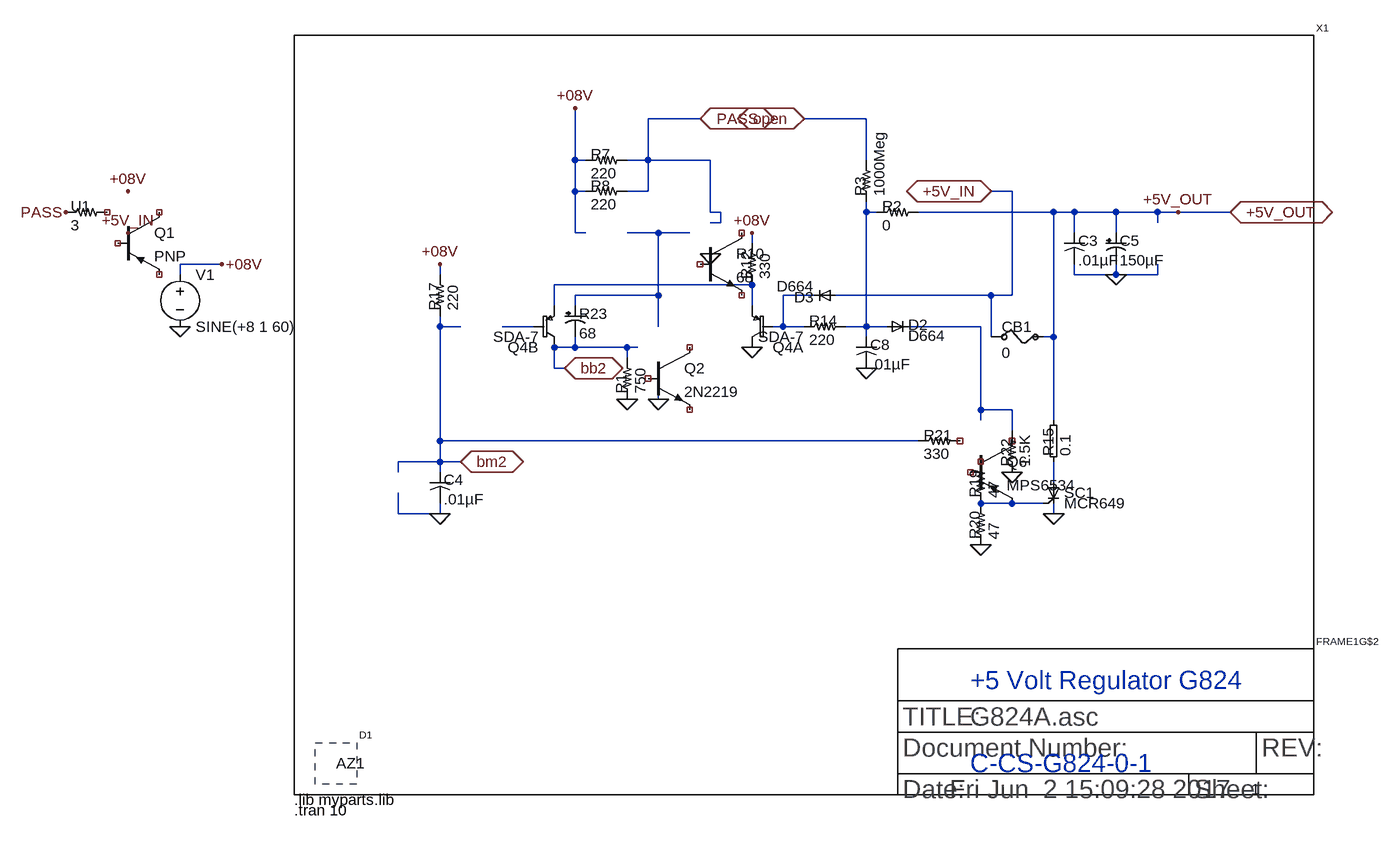
[diagram p0: schematic G824A.asc]
G824A.asc, the LTspice schematic file:
Version 4
SHEET 1 1572 36
WIRE 624 -1040 544 -1040
WIRE 880 -1040 784 -1040
WIRE 432 -976 432 -1056
WIRE 448 -976 432 -976
WIRE 544 -976 544 -1040
WIRE 544 -976 512 -976
WIRE 640 -976 544 -976
WIRE 880 -976 880 -1040
WIRE 432 -928 432 -976
WIRE 448 -928 432 -928
WIRE 544 -928 544 -976
WIRE 544 -928 512 -928
WIRE 1104 -928 1072 -928
WIRE 640 -896 640 -976
WIRE 656 -896 640 -896
WIRE 880 -896 880 -912
WIRE 896 -896 880 -896
WIRE 1168 -896 960 -896
WIRE 1200 -896 1168 -896
WIRE 1264 -896 1200 -896
WIRE 1328 -896 1264 -896
WIRE 1360 -896 1328 -896
WIRE 1440 -896 1360 -896
WIRE 656 -880 656 -896
WIRE 656 -880 640 -880
WIRE 1328 -880 1328 -896
WIRE 432 -864 432 -928
WIRE 448 -864 432 -864
WIRE 560 -864 512 -864
WIRE 608 -864 560 -864
WIRE 1200 -864 1200 -896
WIRE 1264 -864 1264 -896
WIRE 704 -848 704 -864
WIRE -112 -816 -176 -816
WIRE -176 -800 -176 -816
WIRE 224 -800 224 -816
WIRE 1200 -800 1200 -816
WIRE 1264 -800 1264 -816
WIRE 1264 -800 1200 -800
WIRE 1328 -800 1328 -816
WIRE 1328 -800 1264 -800
WIRE 704 -784 400 -784
WIRE 560 -768 560 -864
WIRE 560 -768 432 -768
WIRE 800 -768 752 -768
WIRE 1072 -768 832 -768
WIRE 1104 -768 1104 -928
WIRE 1104 -768 1072 -768
WIRE 400 -752 400 -784
WIRE 432 -752 432 -768
WIRE 704 -752 704 -784
WIRE 224 -720 224 -736
WIRE 256 -720 224 -720
WIRE 368 -720 320 -720
WIRE 560 -720 560 -768
WIRE 752 -720 752 -768
WIRE 752 -720 736 -720
WIRE 784 -720 752 -720
WIRE 880 -720 880 -896
WIRE 880 -720 848 -720
WIRE 912 -720 880 -720
WIRE 1056 -720 944 -720
WIRE 880 -704 880 -720
WIRE 1072 -704 1072 -768
WIRE 1168 -704 1168 -896
WIRE 1168 -704 1152 -704
WIRE 432 -688 432 -704
WIRE 432 -688 400 -688
WIRE 512 -688 432 -688
WIRE 528 -688 512 -688
WIRE 512 -672 512 -688
WIRE 400 -656 400 -688
WIRE 416 -656 400 -656
WIRE 560 -608 560 -656
WIRE 1056 -592 1056 -720
WIRE 1104 -592 1056 -592
WIRE 1056 -576 1056 -592
WIRE 1168 -576 1168 -704
WIRE 1104 -560 1104 -592
WIRE 224 -544 224 -720
WIRE 960 -544 224 -544
WIRE 224 -512 224 -544
WIRE 224 -512 160 -512
WIRE 256 -512 224 -512
WIRE 160 -496 160 -512
WIRE 224 -496 224 -512
WIRE 1168 -480 1168 -512
WIRE 1152 -448 1056 -448
WIRE 160 -432 160 -464
WIRE 224 -432 224 -448
WIRE 224 -432 160 -432
WIRE 1168 -432 1168 -448
FLAG 1360 -896 +5V_OUT
FLAG 224 -432 0
FLAG 704 -688 0
FLAG 432 -1056 +08V
FLAG 560 -608 0
FLAG 512 -608 0
FLAG 704 -864 +08V
FLAG 640 -832 0
FLAG 224 -816 +08V
FLAG 1056 -384 0
FLAG 1104 -496 0
FLAG 1264 -800 0
FLAG 880 -656 0
FLAG 1168 -432 0
FLAG 256 -512 bm2
IOPIN 256 -512 BiDir
FLAG 416 -656 bb2
IOPIN 416 -656 BiDir
FLAG 1072 -928 +5V_IN
IOPIN 1072 -928 BiDir
FLAG 1440 -896 +5V_OUT
IOPIN 1440 -896 BiDir
FLAG 624 -1040 PASS
IOPIN 624 -1040 BiDir
FLAG 784 -1040 open
IOPIN 784 -1040 BiDir
FLAG -176 -720 0
FLAG -112 -816 +08V
FLAG -352 -896 PASS
FLAG -256 -928 +08V
FLAG -256 -864 +5V_IN
SYMBOL DOCFIELD 928 0 R0
SYMATTR InstName FRAME1G$2
SYMATTR Value 1
SYMBOL DEVICE 64 -48 R0
SYMATTR InstName U$1
SYMATTR Value OUTLINE-DOUBLE
SYMBOL R-US 288 -720 MR0
SYMATTR InstName R13
SYMATTR Value 220
SYMATTR SpiceLine pwr=0.5W
SYMBOL ZD 160 -480 MR270
SYMATTR InstName D1
SYMATTR Value AZ1
SYMBOL C-US 224 -480 R0
SYMATTR InstName C4
SYMATTR Value .01µF
SYMATTR Prefix C
SYMBOL R-US 816 -720 R0
SYMATTR InstName R14
SYMATTR Value 220
SYMATTR SpiceLine pwr=0.5W
SYMBOL R-US 224 -768 R270
SYMATTR InstName R17
SYMATTR Value 220
SYMATTR SpiceLine pwr=0.5W
SYMBOL R-US 480 -976 R0
SYMATTR InstName R7
SYMATTR Value 220
SYMATTR SpiceLine pwr=0.5W
SYMBOL R-US 480 -928 R0
SYMATTR InstName R8
SYMATTR Value 220
SYMATTR SpiceLine pwr=0.5W
SYMBOL PNP-L 720 -720 R180
SYMATTR InstName Q4A
SYMATTR Value SDA-7
SYMATTR Prefix Q
SYMBOL PNP-R 448 -720 R180
SYMATTR InstName Q4B
SYMATTR Value SDA-7
SYMATTR Prefix Q
SYMBOL NPN 624 -864 R0
SYMATTR InstName Q3A
SYMATTR Value DEC3715
SYMBOL R-US_ 480 -864 MR0
SYMATTR InstName R10
SYMATTR Value 68
SYMATTR Prefix R
SYMATTR SpiceLine pwr=1W
SYMBOL NPN 544 -688 R0
SYMATTR InstName Q2
SYMATTR Value 2N2219
SYMBOL R-US 512 -640 R270
SYMATTR InstName R1
SYMATTR Value 750
SYMBOL R-US 704 -816 R270
SYMATTR InstName R12
SYMATTR Value 330
SYMATTR SpiceLine tol=5%
SYMBOL CPOL-US 432 -736 R0
SYMATTR InstName C21
SYMATTR Value 1µF
SYMBOL R-US_ 1328 -848 MR90
SYMATTR InstName R23
SYMATTR Value 68
SYMATTR Prefix R
SYMATTR SpiceLine pwr=1W
SYMBOL R-US 992 -544 R0
SYMATTR InstName R21
SYMATTR Value 330
SYMATTR SpiceLine tol=5%
SYMBOL PNP 1040 -544 R0
SYMATTR InstName Q6
SYMATTR Value MPS6534
SYMBOL R-US 1056 -480 R270
SYMATTR InstName R19
SYMATTR Value 47
SYMBOL R-US 1056 -416 R270
SYMATTR InstName R20
SYMATTR Value 47
SYMBOL R-US 1104 -528 R270
SYMATTR InstName R22
SYMATTR Value 1.5K
SYMATTR SpiceLine tol=5%
SYMBOL R 1168 -544 R270
SYMATTR InstName R15
SYMATTR Value 0.1
SYMATTR Prefix R
SYMATTR SpiceLine tol=5% pwr=5W
SYMBOL CPOL-US 1264 -848 R0
SYMATTR InstName C5
SYMATTR Value 150µF
SYMBOL C-US 1200 -848 R0
SYMATTR InstName C3
SYMATTR Value .01µF
SYMATTR Prefix C
SYMBOL C-US 880 -688 R0
SYMATTR InstName C8
SYMATTR Value .01µF
SYMATTR Prefix C
SYMBOL R-US 928 -896 R0
SYMATTR InstName R2
SYMATTR Value 0
SYMBOL R-US 880 -944 R270
SYMATTR InstName R3
SYMATTR Value 1000Meg
SYMBOL D 928 -720 R0
SYMATTR InstName D2
SYMATTR Value D664
SYMBOL D 816 -768 R180
SYMATTR InstName D3
SYMATTR Value D664
SYMBOL SCR 1168 -464 R0
SYMATTR InstName SC1
SYMATTR Value MCR649
SYMBOL BREAKER 1120 -704 R0
SYMATTR InstName CB1
SYMATTR Value 0
SYMATTR Prefix R
SYMBOL LETTER_L 0 0 R0
SYMATTR InstName X1
SYMBOL voltage -176 -816 R0
WINDOW 123 24 32 Left 2
WINDOW 39 24 32 Left 2
SYMATTR InstName V1
SYMATTR Value SINE(+8 1 60)
SYMBOL R-US_ -320 -896 R0
SYMATTR InstName U1
SYMATTR Value 3
SYMATTR Prefix R
SYMBOL pnp -272 -896 R0
SYMATTR InstName Q1
TEXT 1040 -176 Left 4 ;+5 Volt Regulator G824
TEXT 1040 -48 Left 4 ;C-CS-G824-0-1
TEXT 0 8 Left 2 !.lib myparts.lib
TEXT 0 24 Left 2 !.tran 10

The netlist it stands for:
* G824A.asc
-§FRAME1G$2 1
-§D1 AZ1 pwr=0.5W
C4 bm2 0 .01µF
R14 N001 N004 220 pwr=0.5W
R17 +08V bm2 220 pwr=0.5W
R7 PASS +08V 220 pwr=0.5W
R8 PASS +08V 220 pwr=0.5W
Q4A 0 N004 N003 0 SDA-7
Q4B bb2 N005 N003 0 SDA-7
* R10: 68 pwr=1W (symbol NPN not certain, pin order unknown); nets seen at it: 
* Q2: 2N2219 (symbol NPN not certain, pin order unknown); nets seen at it: 0
R1 bb2 0 750
R12 +08V N003 330 tol=5%
R23 N002 bb2 68 pwr=1W
R21 NC_07 bm2 330 tol=5%
Q6 NC_08 NC_09 N008 0 MPS6534
R19 NC_10 N008 47
R20 N008 0 47
R22 N006 0 1.5K tol=5%
R15 +5V_OUT N007 0.1 tol=5% pwr=5W
C5 +5V_OUT 0 150µF
C3 +5V_OUT 0 .01µF
C8 N001 0 .01µF
R2 +5V_OUT N001 0
R3 open N001 1000Meg
D2 N001 N006 D664
D3 +5V_IN N004 D664
XSC1 N007 N008 0 MCR649  ; pins A G C
R§CB1 +5V_IN +5V_OUT 0
-§X1 LETTER_L
V1 +08V 0 SINE(+8 1 60)
R§U1 NC_11 PASS 3
* Q1: PNP (symbol pnp not certain, pin order unknown); nets seen at it: 0
.model D D
.lib standard.dio
.model NPN NPN
.model PNP PNP
.lib standard.bjt
* +5 Volt Regulator G824
* C-CS-G824-0-1
.lib myparts.lib
.tran 10
.backanno
.end